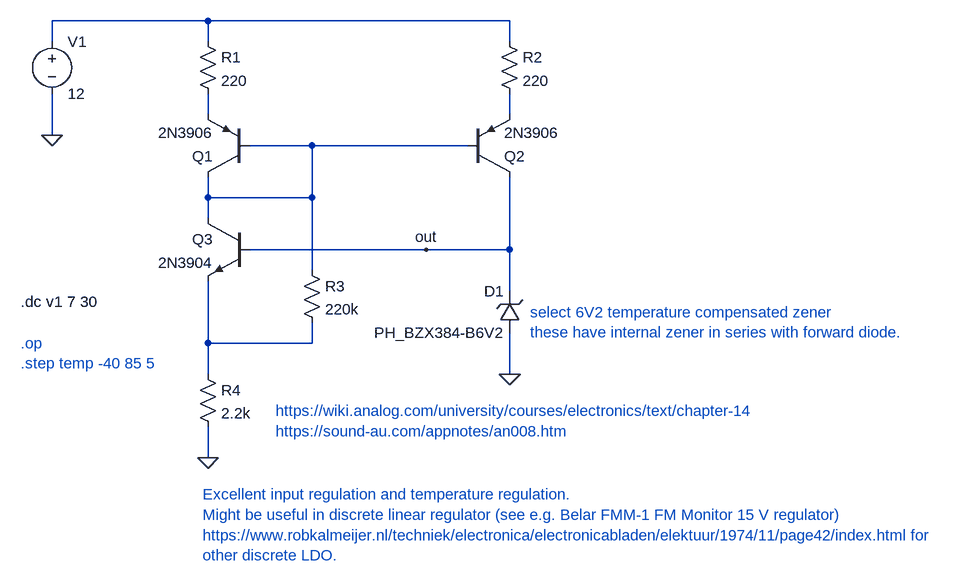
[diagram p0: schematic voltage_reference3.asc]
voltage_reference3.asc, the LTspice schematic file:
Version 4
SHEET 1 1620 800
WIRE 128 -32 -112 -32
WIRE 592 -32 128 -32
WIRE -112 0 -112 -32
WIRE 128 0 128 -32
WIRE 592 0 592 -32
WIRE 128 112 128 80
WIRE 592 112 592 80
WIRE -112 144 -112 80
WIRE 288 160 192 160
WIRE 528 160 288 160
WIRE 128 240 128 208
WIRE 288 240 288 160
WIRE 288 240 128 240
WIRE 128 272 128 240
WIRE 464 320 192 320
WIRE 592 320 592 208
WIRE 592 320 464 320
WIRE 288 352 288 240
WIRE 592 384 592 320
WIRE 128 464 128 368
WIRE 288 464 288 432
WIRE 288 464 128 464
WIRE 128 512 128 464
WIRE 592 512 592 448
WIRE 128 640 128 592
FLAG -112 144 0
FLAG 128 640 0
FLAG 592 512 0
FLAG 464 320 out
SYMBOL res 112 -16 R0
SYMATTR InstName R1
SYMATTR Value 220
SYMBOL res 576 -16 R0
SYMATTR InstName R2
SYMATTR Value 220
SYMBOL res 272 336 R0
SYMATTR InstName R3
SYMATTR Value 220k
SYMBOL res 112 496 R0
SYMATTR InstName R4
SYMATTR Value 2.2k
SYMBOL pnp 192 208 R180
SYMATTR InstName Q1
SYMATTR Value 2N3906
SYMBOL pnp 528 208 M180
SYMATTR InstName Q2
SYMATTR Value 2N3906
SYMBOL npn 192 272 M0
SYMATTR InstName Q3
SYMATTR Value 2N3904
SYMBOL zener 608 448 R180
WINDOW 0 24 64 Left 2
WINDOW 3 24 0 Left 2
SYMATTR InstName D1
SYMATTR Value PH_BZX384-B6V2
SYMATTR Description Diode
SYMATTR Type diode
SYMBOL voltage -112 -16 R0
WINDOW 123 0 0 Left 0
WINDOW 39 0 0 Left 0
SYMATTR InstName V1
SYMATTR Value 12
TEXT -160 400 Left 2 !.dc v1 7 30
TEXT 624 416 Left 2 ;select 6V2 temperature compensated zener \nthese have internal zener in series with forward diode.
TEXT 232 568 Left 2 ;https://wiki.analog.com/university/courses/electronics/text/chapter-14\nhttps://sound-au.com/appnotes/an008.htm
TEXT -160 464 Left 2 ;.op\n.step temp -40 85 5
TEXT 120 696 Left 2 ;Excellent input regulation and temperature regulation.
TEXT 120 728 Left 2 ;Might be useful in discrete linear regulator (see e.g. Belar FMM-1 FM Monitor 15 V regulator)\nhttps://www.robkalmeijer.nl/techniek/electronica/electronicabladen/elektuur/1974/11/page42/index.html for\nother discrete LDO.

The netlist it stands for:
* voltage_reference3.asc
R1 N001 N002 220
R2 N001 N003 220
R3 N004 N005 220k
R4 N005 0 2.2k
Q1 N004 N004 N002 0 2N3906
Q2 out N004 N003 0 2N3906
Q3 N004 out N005 0 2N3904
D1 0 out PH_BZX384-B6V2
V1 N001 0 12
.model D D
.lib standard.dio
.model NPN NPN
.model PNP PNP
.lib standard.bjt
.dc v1 7 30
* select 6V2 temperature compensated zener
* these have internal zener in series with forward diode.
* https://wiki.analog.com/university/courses/electronics/text/chapter-14
* https://sound-au.com/appnotes/an008.htm
* .op
* .step temp -40 85 5
* Excellent input regulation and temperature regulation.
* Might be useful in discrete linear regulator (see e.g. Belar FMM-1 FM Monitor 15 V regulator)
* https://www.robkalmeijer.nl/techniek/electronica/electronicabladen/elektuur/1974/11/page42/index.html for
* other discrete LDO.
.backanno
.end